# EAGLE schematic receiverNode_Uno (EAGLE 6.6.0)
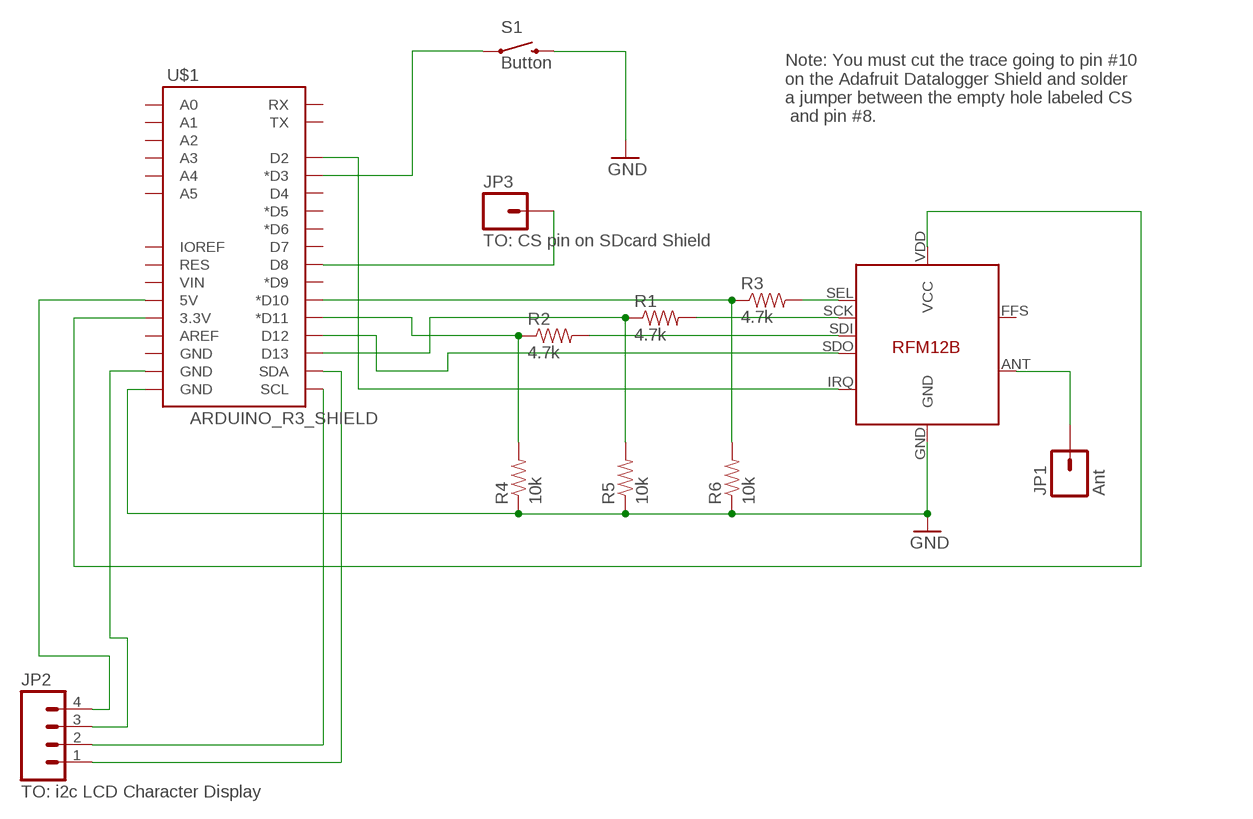
[diagram p0: schematic, sheet 1]

## Parts
JP1  Ant  M01PTH_LONGPAD  [1X01_LONGPAD]
JP2  TO: i2c LCD Character Display  M04LONGPADS  [1X04_LONGPADS]
JP3  TO: CS pin on SDcard Shield  M01PTH_LONGPAD  [1X01_LONGPAD]
R1  4.7k  RESISTORAXIAL-0.3  [AXIAL-0.3]
R2  4.7k  RESISTORAXIAL-0.3  [AXIAL-0.3]
R3  4.7k  RESISTORAXIAL-0.3  [AXIAL-0.3]
R4  10k  RESISTORAXIAL-0.3  [AXIAL-0.3]
R5  10k  RESISTORAXIAL-0.3  [AXIAL-0.3]
R6  10k  RESISTORAXIAL-0.3  [AXIAL-0.3]
S1  Button  SWITCH-MOMENTARY-2PTH  [TACTILE-PTH]
U$1  ARDUINO_R3_SHIELD  [UNO_R3_SHIELD]
U$2  RFM12B  [RFM12B]

## Nets
GND: R4.P$1 R5.P$1 R6.P$1 S1.3 U$1.GND@0(GND) U$2.GND
N$1: R1.P$2 U$2.SCK
N$2: R2.P$2 U$2.SDI
N$3: R3.P$2 U$2.SEL
N$4: U$1.D12 U$2.SDO
N$5: R1.P$1 R5.P$2 U$1.D13
N$6: R3.P$1 R6.P$2 U$1.D10(*D10)
N$7: JP1.1 U$2.ANT
N$8: U$1.D2 U$2.IRQ
N$9: R2.P$1 R4.P$2 U$1.D11(*D11)
N$10: JP2.4 U$1.5V
N$11: JP2.1 U$1.SDA
N$12: U$1.3.3V U$2.VDD(VCC)
N$14: JP2.3 U$1.GND@1(GND)
N$15: JP3.1 U$1.D8
N$16: S1.1 U$1.D3(*D3)
N$18: JP2.2 U$1.SCL
Unconnected: U$1.A0 U$1.A1 U$1.A2 U$1.A3 U$1.A4 U$1.A5 U$1.AREF U$1.D4 U$1.D5(*D5) U$1.D6(*D6) U$1.D7 U$1.D9(*D9) U$1.GND@2(GND) U$1.IOREF U$1.RES U$1.RX U$1.TX U$1.VIN U$2.FFS

## Notes on the sheet
- Note: You must cut the trace going to pin #10 
  on the Adafruit Datalogger Shield and solder 
  a jumper between the empty hole labeled CS
   and pin #8.

## Library data of the parts
JP1 JP3 = SparkFun-Connectors:M01: Header 1 Standard 1-pin 0.1" header. Use with straight break away headers (SKU : PRT-00116), right angle break away headers (PRT-00553), swiss pins (PRT-00743), machine pins (PRT-00117), and female headers (PRT-00115).
JP2 = SparkFun-Connectors:M04: Header 4 Standard 4-pin 0.1" header. Use with straight break away headers (SKU : PRT-00116), right angle break away headers (PRT-00553), swiss pins (PRT-00743), machine pins (PRT-00117), and female headers (PRT-00115). Molex polarized connector foot print use with SKU : PRT-08231 with associated crimp pins and housings. 1MM SMD Version SKU: PRT-10208
R1-R6 = SparkFun-Resistors:RESISTOR: Resistor Basic schematic elements and footprints for 0603, 1206, and PTH resistors.
S1 = SparkFun-Electromechanical:SWITCH-MOMENTARY-2: Various NO switches- pushbuttons, reed, etc
U$1 = SparkFun-Boards:ARDUINO_R3_SHIELD: Shield form compatible with the Arduino Uno R3.
U$2 = JeeParts:RFM12B